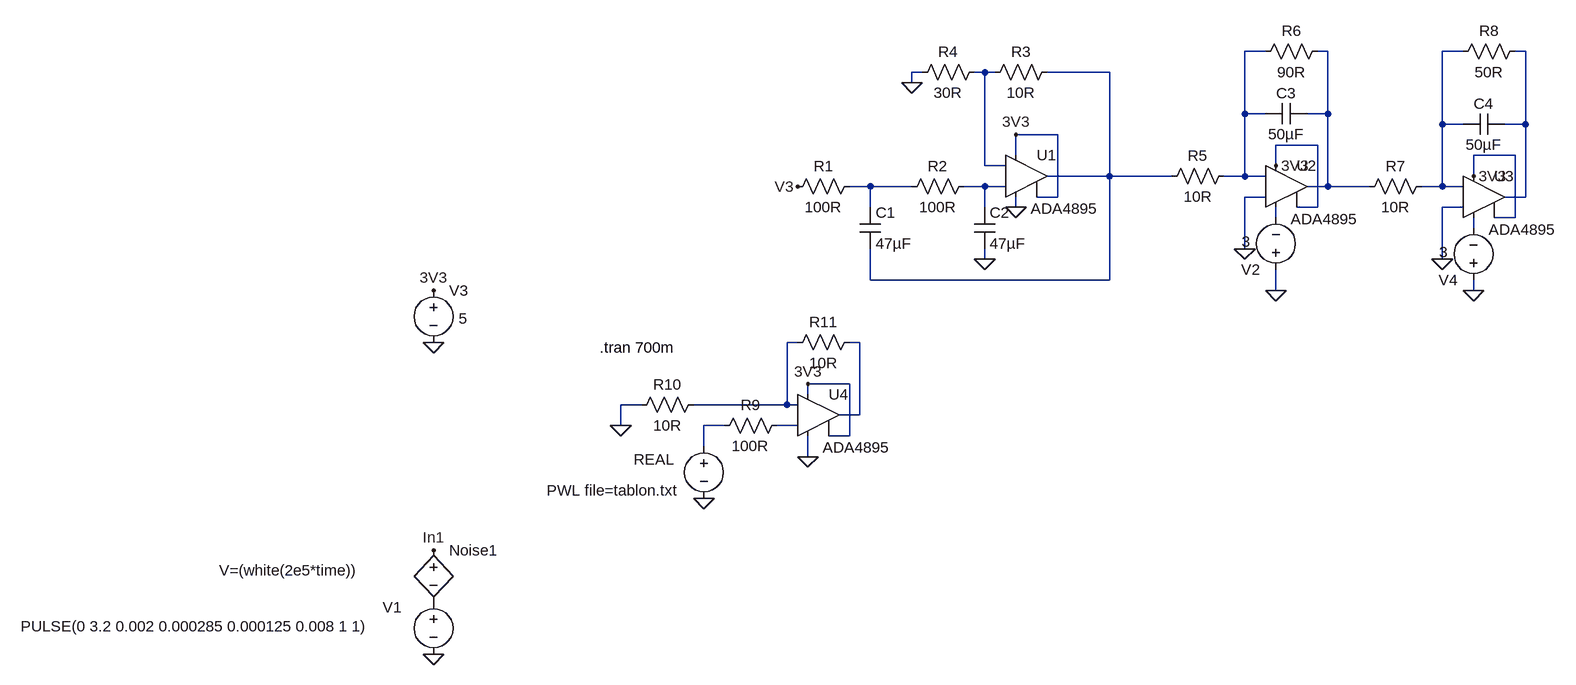
[diagram p0: schematic Sync_IntegratorV1.asc]
Sync_IntegratorV1.asc, the LTspice schematic file:
Version 4
SHEET 1 1784 1124
WIRE 1152 -480 1120 -480
WIRE 1248 -480 1232 -480
WIRE 1456 -480 1424 -480
WIRE 1552 -480 1536 -480
WIRE 624 -448 608 -448
WIRE 720 -448 704 -448
WIRE 736 -448 720 -448
WIRE 912 -448 816 -448
WIRE 608 -432 608 -448
WIRE 1120 -384 1120 -480
WIRE 1152 -384 1120 -384
WIRE 1248 -384 1248 -480
WIRE 1248 -384 1216 -384
WIRE 1424 -368 1424 -480
WIRE 1456 -368 1424 -368
WIRE 1552 -368 1552 -480
WIRE 1552 -368 1520 -368
WIRE 832 -352 768 -352
WIRE 1232 -336 1168 -336
WIRE 768 -320 768 -352
WIRE 1536 -320 1472 -320
WIRE 720 -304 720 -448
WIRE 752 -304 720 -304
WIRE 1168 -304 1168 -336
WIRE 912 -288 912 -448
WIRE 912 -288 816 -288
WIRE 1008 -288 912 -288
WIRE 1120 -288 1120 -384
WIRE 1120 -288 1088 -288
WIRE 1152 -288 1120 -288
WIRE 1472 -288 1472 -320
WIRE 544 -272 512 -272
WIRE 608 -272 544 -272
WIRE 720 -272 688 -272
WIRE 752 -272 720 -272
WIRE 1248 -272 1248 -384
WIRE 1248 -272 1216 -272
WIRE 1312 -272 1248 -272
WIRE 1424 -272 1424 -368
WIRE 1424 -272 1392 -272
WIRE 1456 -272 1424 -272
WIRE 832 -256 832 -352
WIRE 832 -256 800 -256
WIRE 1152 -256 1120 -256
WIRE 1552 -256 1552 -368
WIRE 1552 -256 1520 -256
WIRE 544 -240 544 -272
WIRE 720 -240 720 -272
WIRE 768 -240 768 -256
WIRE 1232 -240 1232 -336
WIRE 1232 -240 1200 -240
WIRE 1456 -240 1424 -240
WIRE 1168 -224 1168 -240
WIRE 1536 -224 1536 -320
WIRE 1536 -224 1504 -224
WIRE 1472 -208 1472 -224
WIRE 1120 -176 1120 -256
WIRE 720 -160 720 -176
WIRE 1424 -160 1424 -240
WIRE 544 -128 544 -176
WIRE 912 -128 912 -288
WIRE 912 -128 544 -128
WIRE 1168 -112 1168 -144
WIRE 1472 -112 1472 -128
WIRE 432 -32 416 -32
WIRE 528 -32 512 -32
WIRE 512 32 448 32
WIRE 448 48 448 32
WIRE 192 64 160 64
WIRE 416 64 416 -32
WIRE 416 64 272 64
WIRE 432 64 416 64
WIRE 528 80 528 -32
WIRE 528 80 496 80
WIRE 160 96 160 64
WIRE 320 96 288 96
WIRE 432 96 400 96
WIRE 512 112 512 32
WIRE 512 112 480 112
WIRE 288 128 288 96
WIRE 448 144 448 112
FLAG -128 -32 0
FLAG -128 -112 3V3
FLAG -128 448 0
FLAG -128 288 In1
FLAG 288 208 0
FLAG 768 -240 0
FLAG 768 -352 3V3
FLAG 608 -432 0
FLAG 1120 -176 0
FLAG 1168 -304 3V3
FLAG 720 -160 0
FLAG 1424 -160 0
FLAG 1472 -288 3V3
FLAG 1472 -112 0
FLAG 1168 -112 0
FLAG 432 -272 V3
FLAG 160 96 0
FLAG 448 144 0
FLAG 448 32 3V3
SYMBOL voltage -128 -128 R0
WINDOW 123 0 0 Left 0
WINDOW 39 0 0 Left 0
WINDOW 3 39 59 Left 2
SYMATTR Value 5
SYMATTR InstName V3
SYMBOL voltage -128 352 R0
WINDOW 123 0 0 Left 0
WINDOW 39 0 0 Left 0
WINDOW 0 -78 24 Left 2
WINDOW 3 -635 53 Left 2
SYMATTR InstName V1
SYMATTR Value PULSE(0 3.2 0.002 0.000285 0.000125 0.008 1 1)
SYMBOL bv -128 272 R0
WINDOW 3 -330 47 Left 2
SYMATTR Value V=(white(2e5*time))
SYMATTR InstName Noise1
SYMBOL voltage 288 112 R0
WINDOW 123 0 0 Left 0
WINDOW 39 0 0 Left 0
WINDOW 3 -40 84 Right 2
WINDOW 0 -46 36 Right 2
SYMATTR Value PWL file=tablon.txt
SYMATTR InstName REAL
SYMBOL OpAmps\\ADA4895 784 -288 R0
WINDOW 3 7 50 Left 2
SYMATTR InstName U1
SYMBOL res 528 -288 R90
WINDOW 0 0 56 VBottom 2
WINDOW 3 32 56 VTop 2
SYMATTR InstName R1
SYMATTR Value 100R
SYMBOL cap 528 -240 R0
SYMATTR InstName C1
SYMATTR Value 47µF
SYMBOL res 704 -288 R90
WINDOW 0 0 56 VBottom 2
WINDOW 3 32 56 VTop 2
SYMATTR InstName R2
SYMATTR Value 100R
SYMBOL cap 704 -240 R0
SYMATTR InstName C2
SYMATTR Value 47µF
SYMBOL res 832 -464 R90
WINDOW 0 0 56 VBottom 2
WINDOW 3 32 56 VTop 2
SYMATTR InstName R3
SYMATTR Value 10R
SYMBOL res 720 -464 R90
WINDOW 0 0 56 VBottom 2
WINDOW 3 32 56 VTop 2
SYMATTR InstName R4
SYMATTR Value 30R
SYMBOL OpAmps\\ADA4895 1184 -272 R0
WINDOW 3 7 50 Left 2
SYMATTR InstName U2
SYMBOL res 1104 -304 R90
WINDOW 0 0 56 VBottom 2
WINDOW 3 32 56 VTop 2
SYMATTR InstName R5
SYMATTR Value 10R
SYMBOL cap 1216 -400 R90
WINDOW 0 0 32 VBottom 2
WINDOW 3 32 32 VTop 2
SYMATTR InstName C3
SYMATTR Value 50µF
SYMBOL OpAmps\\ADA4895 1488 -256 R0
WINDOW 3 7 50 Left 2
SYMATTR InstName U3
SYMBOL res 1408 -288 R90
WINDOW 0 0 56 VBottom 2
WINDOW 3 32 56 VTop 2
SYMATTR InstName R7
SYMATTR Value 10R
SYMBOL cap 1520 -384 R90
WINDOW 0 0 32 VBottom 2
WINDOW 3 32 32 VTop 2
SYMATTR InstName C4
SYMATTR Value 50µF
SYMBOL res 1248 -496 R90
WINDOW 0 0 56 VBottom 2
WINDOW 3 32 56 VTop 2
SYMATTR InstName R6
SYMATTR Value 90R
SYMBOL res 1552 -496 R90
WINDOW 0 0 56 VBottom 2
WINDOW 3 32 56 VTop 2
SYMATTR InstName R8
SYMATTR Value 50R
SYMBOL voltage 1168 -128 R180
WINDOW 123 0 0 Left 0
WINDOW 39 0 0 Left 0
WINDOW 3 39 59 Left 2
SYMATTR Value 3
SYMATTR InstName V2
SYMBOL voltage 1472 -112 R180
WINDOW 123 0 0 Left 0
WINDOW 39 0 0 Left 0
WINDOW 3 39 59 Left 2
SYMATTR Value 3
SYMATTR InstName V4
SYMBOL OpAmps\\ADA4895 464 80 R0
WINDOW 3 7 50 Left 2
SYMATTR InstName U4
SYMBOL res 416 80 R90
WINDOW 0 0 56 VBottom 2
WINDOW 3 32 56 VTop 2
SYMATTR InstName R9
SYMATTR Value 100R
SYMBOL res 288 48 R90
WINDOW 0 0 56 VBottom 2
WINDOW 3 32 56 VTop 2
SYMATTR InstName R10
SYMATTR Value 10R
SYMBOL res 528 -48 R90
WINDOW 0 0 56 VBottom 2
WINDOW 3 32 56 VTop 2
SYMATTR InstName R11
SYMATTR Value 10R
TEXT 128 -24 Left 2 !.tran 700m

The netlist it stands for:
* Sync_IntegratorV1.asc
V3 3V3 0 5
V1 P001 0 PULSE(0 3.2 0.002 0.000285 0.000125 0.008 1 1)
B§Noise1 In1 P001 V=(white(2e5*time))
V§REAL N013 0 PWL file=tablon.txt
XU1 N008 N005 3V3 0 N006 3V3 ADA4895
R1 N007 V3 100R
C1 N007 N006 47µF
R2 N008 N007 100R
C2 N008 0 47µF
R3 N006 N005 10R
R4 N005 0 30R
XU2 0 N001 3V3 N009 N002 3V3 ADA4895
R5 N001 N006 10R
C3 N002 N001 50µF
XU3 0 N003 3V3 N010 N004 3V3 ADA4895
R7 N003 N002 10R
C4 N004 N003 50µF
R6 N002 N001 90R
R8 N004 N003 50R
V2 0 N009 3
V4 0 N010 3
XU4 N014 N011 3V3 0 N012 3V3 ADA4895
R9 N014 N013 100R
R10 N011 0 10R
R11 N012 N011 10R
.tran 700m
.lib ADA4895.lib
.backanno
.end